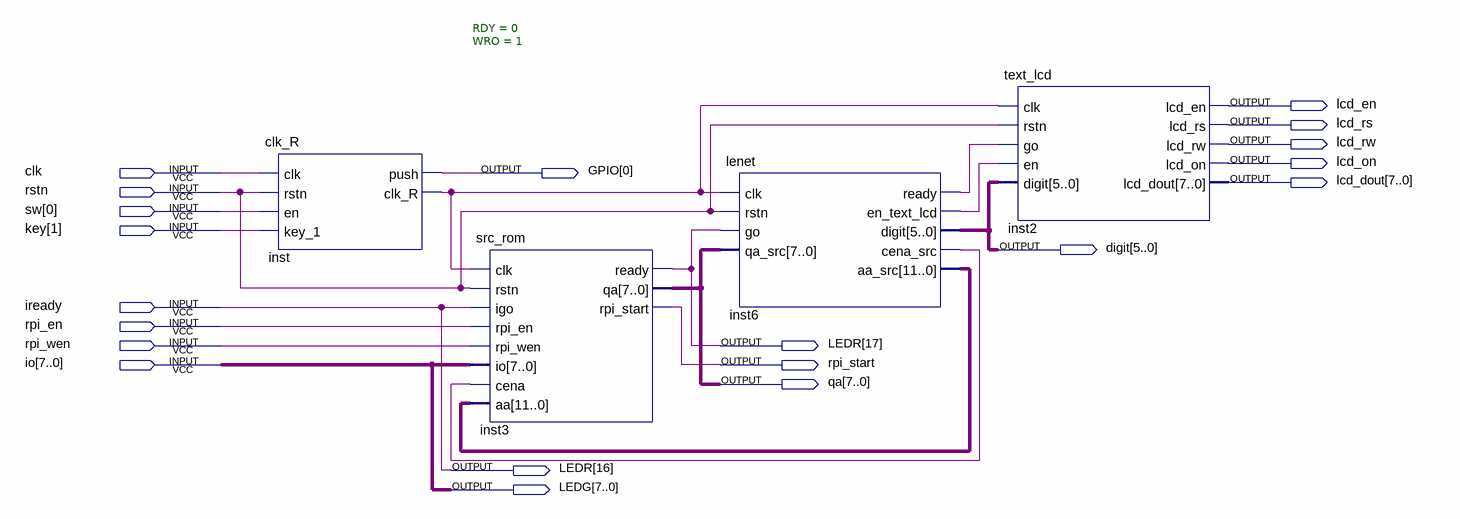
[diagram p0: schematic sheet]
// Quartus schematic CNN_block.bdf as structural Verilog: 4 symbols, 20 pins
module CNN_block (
  input  clk,
  input  rstn,
  input  [0:0] sw,
  input  [1:1] key,
  input  iready,
  input  rpi_en,
  input  rpi_wen,
  input  [7:0] io,
  output lcd_en,
  output lcd_rs,
  output lcd_rw,
  output lcd_on,
  output [0:0] GPIO,
  output [7:0] lcd_dout,
  output [5:0] digit,
  output [17:16] LEDR,
  output rpi_start,
  output [7:0] qa,
  output [7:0] LEDG
);

  wire inst6_cena_src, inst6_en_text_lcd, inst6_ready, inst_clk_r;
  wire [11:0] inst6_aa_src;

  clk_R inst (.clk(clk), .rstn(rstn), .en(sw[0]), .key_1(key[1]), .push(GPIO[0]), .clk_R(inst_clk_r));
  src_rom #(.RDY(0), .WRO(1)) inst3 (
    .clk(inst_clk_r), .rstn(rstn), .igo(iready), .rpi_en(rpi_en), .rpi_wen(rpi_wen), .io(io),
    .cena(inst6_cena_src), .aa(inst6_aa_src), .ready(LEDR[17]), .qa(qa), .rpi_start(rpi_start));
  lenet inst6 (
    .clk(inst_clk_r), .rstn(rstn), .go(LEDR[17]), .qa_src(qa), .ready(inst6_ready),
    .en_text_lcd(inst6_en_text_lcd), .digit(digit), .cena_src(inst6_cena_src), .aa_src(inst6_aa_src));
  text_lcd inst2 (
    .clk(inst_clk_r), .rstn(rstn), .go(inst6_ready), .en(inst6_en_text_lcd), .digit(digit), .lcd_en(lcd_en),
    .lcd_rs(lcd_rs), .lcd_rw(lcd_rw), .lcd_on(lcd_on), .lcd_dout(lcd_dout));

  assign LEDG = io;
  assign LEDR[16] = iready;
endmodule
